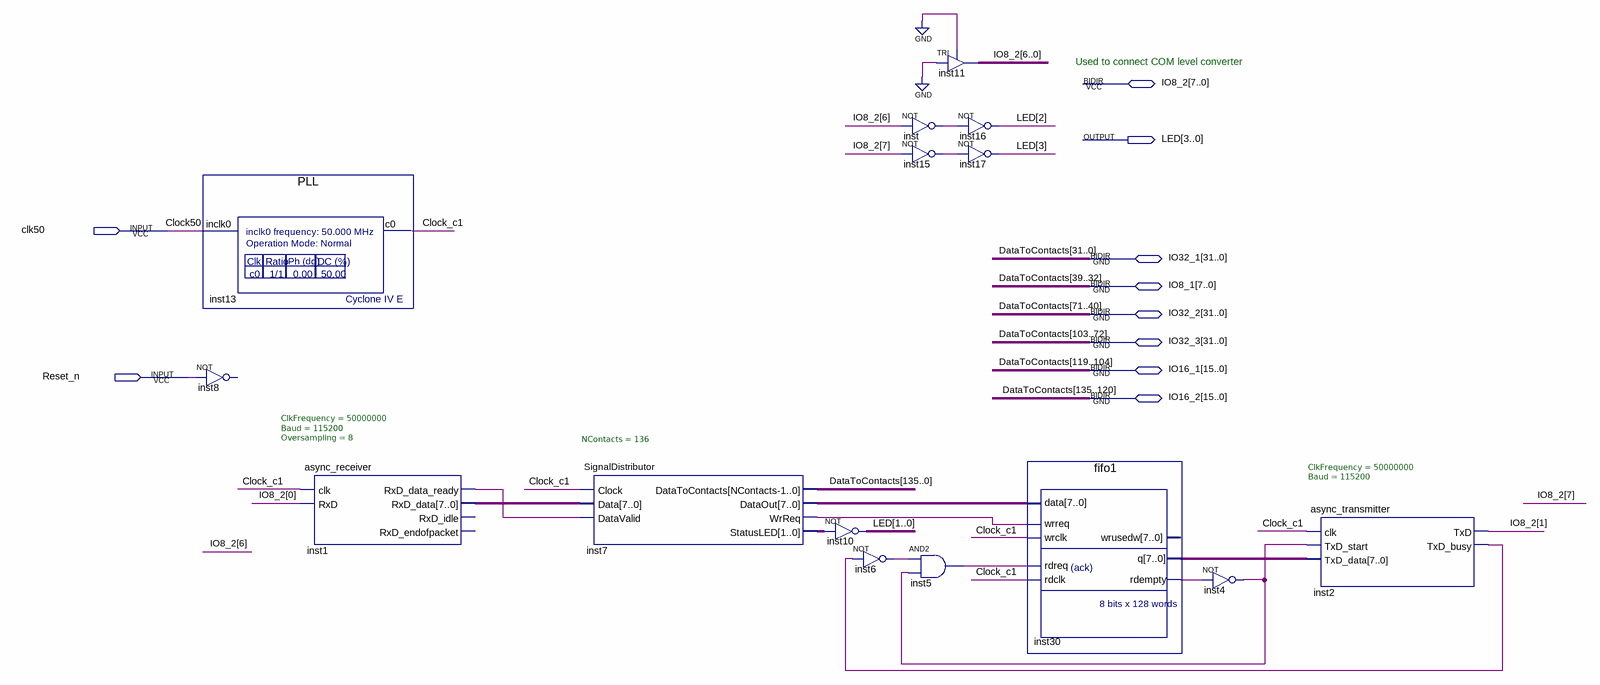
[diagram p0: schematic sheet]
// Quartus schematic DevBD.bdf as structural Verilog: 15 symbols, 10 pins
module DevBD (
  input  clk50,
  input  Reset_n,
  inout  [7:0] IO8_2,
  inout  [31:0] IO32_1,
  inout  [7:0] IO8_1,
  inout  [31:0] IO32_2,
  inout  [31:0] IO32_3,
  inout  [15:0] IO16_1,
  inout  [15:0] IO16_2,
  output [3:0] LED
);

  wire Clock_c1, inst1_rxd_data_ready, inst2_txd_busy, inst4_out, inst5_out, inst6_out, inst7_wrreq,
       inst15_out, inst30_rdempty, inst_out;
  wire [1:0] inst7_statusled;
  wire [7:0] inst1_rxd_data, inst7_dataout, inst30_q;

  // NOT inst8 has open pins: IN=Reset_n, OUT=open
  PLL inst13 (.inclk0(clk50), .c0(Clock_c1));
  async_receiver #(.ClkFrequency(50000000), .Baud(115200), .Oversampling(8)) inst1 (
    .clk(Clock_c1), .RxD(IO8_2[0]), .RxD_data_ready(inst1_rxd_data_ready), .RxD_data(inst1_rxd_data));  // open: RxD_idle, RxD_endofpacket
  SignalDistributor #(.NContacts(136)) inst7 (
    .Clock(Clock_c1), .Data(inst1_rxd_data), .DataValid(inst1_rxd_data_ready), .DataOut(inst7_dataout),
    .WrReq(inst7_wrreq), .StatusLED(inst7_statusled),
    .DataToContacts({IO16_2, IO16_1, IO32_3, IO32_2, IO8_1, IO32_1}));
  assign LED[1:0] = ~inst7_statusled;  // NOT inst10, 2 bits wide
  not inst6 (inst6_out, inst2_txd_busy);
  not inst (inst_out, IO8_2[6]);
  not inst15 (inst15_out, IO8_2[7]);
  and inst5 (inst5_out, inst6_out, inst4_out);
  TRI inst11[6:0] (.IN(1'b0), .OE(1'b0), .OUT(IO8_2[6:0]));
  not inst16 (LED[2], inst_out);
  not inst17 (LED[3], inst15_out);
  fifo1 inst30 (
    .data(inst7_dataout), .wrreq(inst7_wrreq), .wrclk(Clock_c1), .rdreq(inst5_out), .rdclk(Clock_c1),
    .q(inst30_q), .rdempty(inst30_rdempty));  // open: wrusedw
  not inst4 (inst4_out, inst30_rdempty);
  async_transmitter #(.ClkFrequency(50000000), .Baud(115200)) inst2 (
    .clk(Clock_c1), .TxD_start(inst4_out), .TxD_data(inst30_q), .TxD(IO8_2[1]), .TxD_busy(inst2_txd_busy));

  // Other names for the same wires on the sheet: Clock50 = clk50;
  //   DataToContacts[135:0] = {IO16_2, IO16_1, IO32_3, IO32_2, IO8_1, IO32_1}

  // Notes on the sheet:
  //   Used to connect COM level converter
endmodule
